# Altium schematic sheet Sheet1.SchDoc
size 431 x 279 mm; SheetNumber: 1; SheetTotal: 1
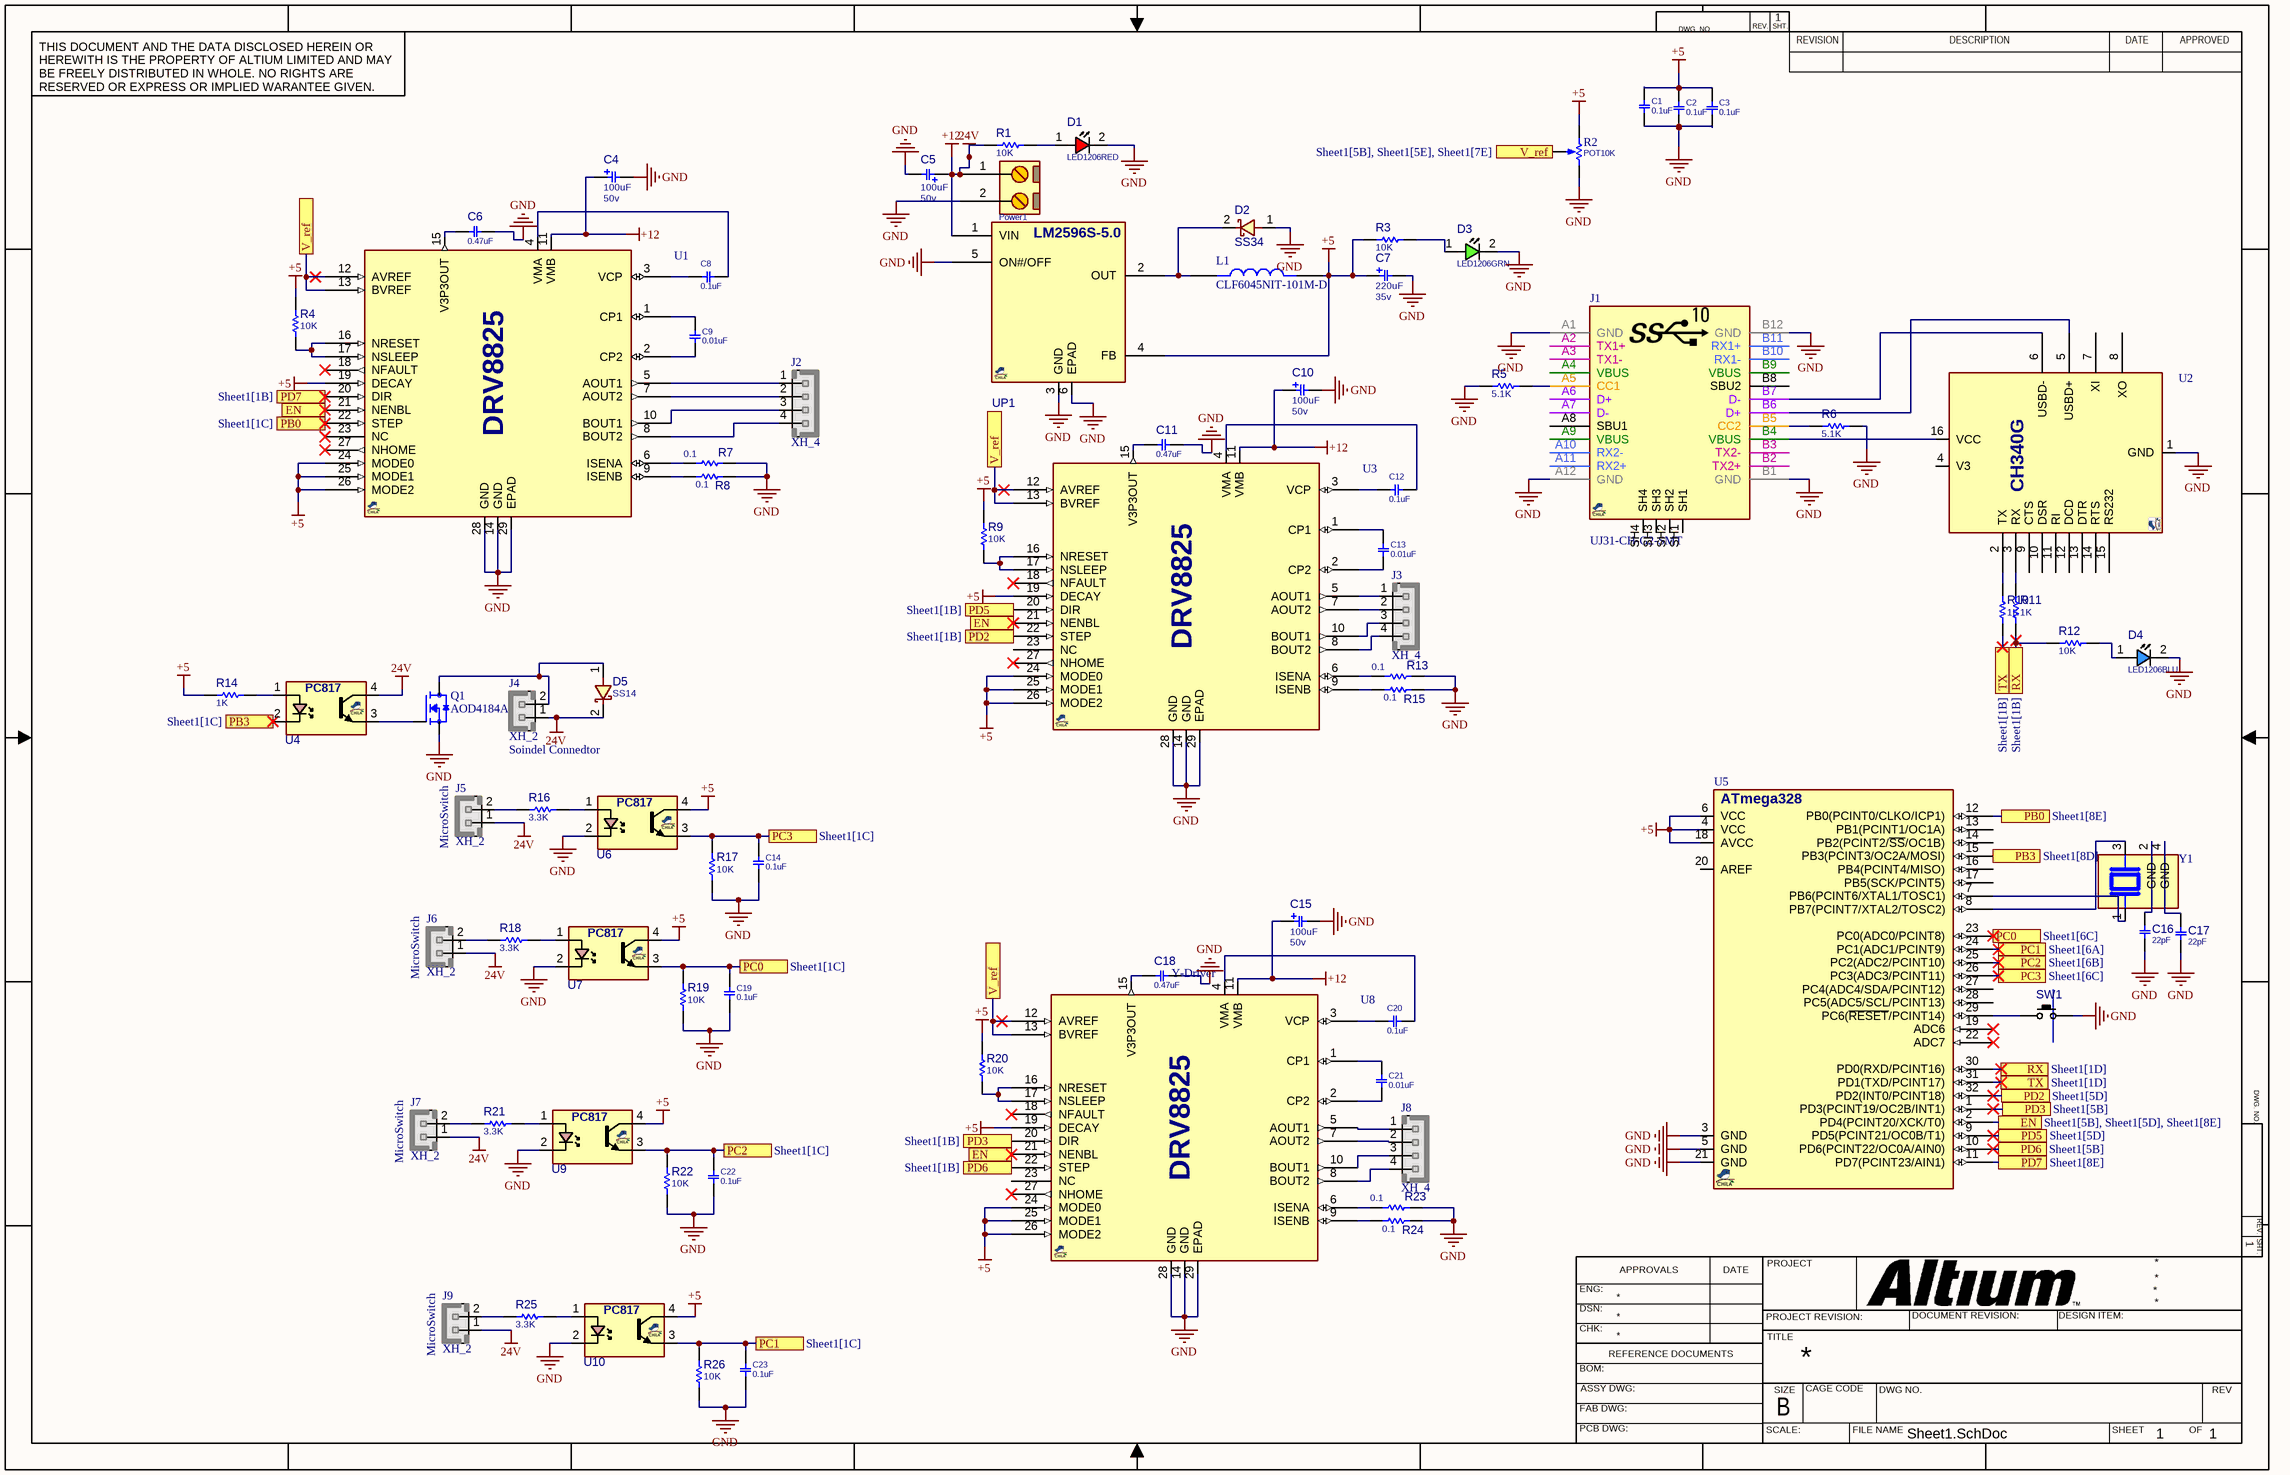
[diagram p0: Sheet1.SchDoc]

## Parts
C1  0.1uF  [C0402]
C2  0.1uF  [C0402]
C3  0.1uF  [C0402]
C4  PARAM2: 50v  [C_EL_D8L10]  (hidden comment: 100uF)
C5  PARAM2: 50v  [C_EL_D8L10]  (hidden comment: 100uF)
C6  0.47uF  [C0402]
C7  PARAM2: 35v  [C_EL_D8L10]  (hidden comment: 220uF)
C8  0.1uF  [C0402]
C9  0.01uF  [C0402]
C10  PARAM2: 50v  [C_EL_D8L10]  (hidden comment: 100uF)
C11  0.47uF  [C0402]
C12  0.1uF  [C0402]
C13  0.01uF  [C0402]
C14  0.1uF  [C0402]
C15  PARAM2: 50v  [C_EL_D8L10]  (hidden comment: 100uF)
C16  22pF  [C0402]
C17  22pF  [C0402]
C18  0.47uF  [C0402]
C19  0.1uF  [C0402]
C20  0.1uF  [C0402]
C21  0.01uF  [C0402]
C22  0.1uF  [C0402]
C23  0.1uF  [C0402]
D1  LED1206RED  [LED1206RED]
D2  SS34  [D_SMB]
D3  LED1206GRN  [LED1206GRN]
D4  LED1206BLU  [LED1206BLU]
D5  SS14  [D_SMB]
J1  UJ31-CH-G2-SMT  [USBC_HYB_UJ31CHG2SMT]
J2  XH_4  [XH_R_SMD_4]
J3  XH_4  [XH_R_SMD_4]
J4  Soindel Connedtor  value XH_2  [XH_R_SMD_2]
J5  MicroSwitch  value XH_2  [XH_R_SMD_2]
J6  MicroSwitch  value XH_2  [XH_R_SMD_2]
J7  MicroSwitch  value XH_2  [XH_R_SMD_2]
J8  XH_4  [XH_R_SMD_4]
J9  MicroSwitch  value XH_2  [XH_R_SMD_2]
L1  CLF6045NIT-101M-D  [IND_CLF6045NIT-101M-D]
Power1  CONN_TB2  [TBG_2]  (value not drawn)
Q1  AOD4184A  [DPAK228P994X240-4N]
R1  10K  [R0402]
R2  POT10K  [POTS_3MM]
R3  10K  [R0402]
R4  10K  [R0402]
R5  5.1K  [R0402]
R6  5.1K  [R0402]
R7  0.1  [R0402]
R8  0.1  [R0402]
R9  10K  [R0402]
R10  1K  [R0402]
R11  1K  [R0402]
R12  10K  [R0402]
R13  0.1  [R0402]
R14  1K  [R0402]
R15  0.1  [R0402]
R16  3.3K  [R0402]
R17  10K  [R0402]
R18  3.3K  [R0402]
R19  10K  [R0402]
R20  10K  [R0402]
R21  3.3K  [R0402]
R22  10K  [R0402]
R23  0.1  [R0402]
R24  0.1  [R0402]
R25  3.3K  [R0402]
R26  10K  [R0402]
SW1  PUSHBUTTON  [SWPBT_SPST_6X6X5]  (value not drawn)
U1  Z_Driver  [SOG65_28T]  (value not drawn)
U2  CH340G  [SO_16]  (value not drawn)
U3  X_Driver  [SOG65_28T]  (value not drawn)
U4  PC817  [DIP_4]  (value not drawn)
U5  ATMEGA328  [QFG80_32]  (value not drawn)
U6  PC817  [DIP_4]  (value not drawn)
U7  PC817  [DIP_4]  (value not drawn)
U8  Y-Driver  [SOG65_28T]
U9  PC817  [DIP_4]  (value not drawn)
U10  PC817  [DIP_4]  (value not drawn)
UP1  LM2596S-5.0  [D2PAK_5]  (value not drawn)
Y1  C3E-16.000-10-3030-R  [XTAL_C3E-16.000-10-3030-R]  (value not drawn)

## Ports
EN (see Sheet1[1B], Sheet1[5B], Sheet1[5D]), EN (see Sheet1[1B], Sheet1[5B], Sheet1[8E]), EN (see Sheet1[1B], Sheet1[5D], Sheet1[8E]), EN (see Sheet1[5B], Sheet1[5D], Sheet1[8E]), PB0 (see Sheet1[1C]), PB0 (see Sheet1[8E]), PB3 (see Sheet1[1C]), PB3 (see Sheet1[8D]), PC0 (see Sheet1[1C]), PC0 (see Sheet1[6C]), PC1 (see Sheet1[1C]), PC1 (see Sheet1[6A]), PC2 (see Sheet1[1C]), PC2 (see Sheet1[6B]), PC3 (see Sheet1[1C]), PC3 (see Sheet1[6C]), PD2 (see Sheet1[1B]), PD2 (see Sheet1[5D]), PD3 (see Sheet1[1B]), PD3 (see Sheet1[5B]), PD5 (see Sheet1[1B]), PD5 (see Sheet1[5D]), PD6 (see Sheet1[1B]), PD6 (see Sheet1[5B]), PD7 (see Sheet1[1B]), PD7 (see Sheet1[8E]), RX (see Sheet1[1B]), RX (see Sheet1[1D]), TX (see Sheet1[1B]), TX (see Sheet1[1D]), V_ref (see Sheet1[3F], Sheet1[5B], Sheet1[5E]), V_ref (see Sheet1[3F], Sheet1[5B], Sheet1[7E]), V_ref (see Sheet1[3F], Sheet1[5E], Sheet1[7E]), V_ref (see Sheet1[5B], Sheet1[5E], Sheet1[7E])

## Nets
+5: C1.2 C2.2 C3.1 C7.1 L1.2 R2.1(TOP) R3.1 R4.2 R9.2 R14.1 R20.2 U1.19(DECAY) U1.24(MODE0) U1.25(MODE1) U1.26(MODE2) U3.19(DECAY) U3.24(MODE0) U3.25(MODE1) U3.26(MODE2) U5.4(VCC) U5.6(VCC) U5.18(AVCC) U6.4(C) U7.4(C) U8.19(DECAY) U8.24(MODE0) U8.25(MODE1) U8.26(MODE2) U9.4(C) U10.4(C) UP1.4(FB)
+12: C4.1 C5.1 C10.1 C15.1 D5.2 J4.1 J5.1 J6.1 J7.1 J9.1 Power1.1 R1.1 U1.11(VMB) U3.11(VMB) U4.4(C) U8.11(VMB) UP1.1(VIN)  [also labelled 24V]
GND: C1.1 C2.1 C3.2 C4.2 C5.2 C6.2 C7.2 C10.2 C11.2 C14.1 C15.2 C16.2 C17.1 C18.2 C19.1 C22.1 C23.1 D1.2(CATHODE) D2.1 D3.2(CATHODE) D4.2(CATHODE) J1.A1(GND) J1.A12(GND) J1.B1(GND) J1.B12(GND) Power1.2 Q1.3(S) R2.3(BOT) R5.1 R6.2 R7.2 R8.2 R13.2 R15.2 R17.1 R19.1 R22.1 R23.2 R24.2 R26.1 SW1.2 U1.14(GND) U1.28(GND) U1.29(EPAD) U2.1(GND) U3.14(GND) U3.28(GND) U3.29(EPAD) U5.3(GND) U5.5(GND) U5.21(GND) U6.2(K) U7.2(K) U8.14(GND) U8.28(GND) U8.29(EPAD) U9.2(K) U10.2(K) UP1.3(GND) UP1.5(ON#/OFF) UP1.6(EPAD)
EN: U1.21(NENBL) U3.21(NENBL) U5.2(PD4(PCINT20/XCK/T0)) U8.21(NENBL) ; port EN
PB0: U1.22(STEP) U5.12(PB0(PCINT0/CLKO/ICP1)) ; port PB0
PB3: U4.2(K) U5.15(PB3(PCINT3/OC2A/MOSI)) ; port PB3
PC0: C19.2 R19.2 U5.23(PC0(ADC0/PCINT8)) U7.3(E) ; port PC0
PC1: C23.2 R26.2 U5.24(PC1(ADC1/PCINT9)) U10.3(E) ; port PC1
PC2: C22.2 R22.2 U5.25(PC2(ADC2/PCINT10)) U9.3(E) ; port PC2
PC3: C14.2 R17.2 U5.26(PC3(ADC3/PCINT11)) U6.3(E) ; port PC3
PD2: U3.22(STEP) U5.32(PD2(INT0/PCINT18)) ; port PD2
PD3: U5.1(PD3(PCINT19/OC2B/INT1)) U8.20(DIR) ; port PD3
PD5: U3.20(DIR) U5.9(PD5(PCINT21/OC0B/T1)) ; port PD5
PD6: U5.10(PD6(PCINT22/OC0A/AIN0)) U8.22(STEP) ; port PD6
PD7: U1.20(DIR) U5.11(PD7(PCINT23/AIN1)) ; port PD7
RX: R11.1 R12.1 U5.30(PD0(RXD/PCINT16)) ; port RX
TX: R10.1 U5.31(PD1(TXD/PCINT17)) ; port TX
V_ref: R2.2(TAP) U1.12(AVREF) U1.13(BVREF) U3.12(AVREF) U3.13(BVREF) U8.12(AVREF) U8.13(BVREF) ; port V_ref
NetC6_1: C6.1 U1.15(V3P3OUT)
NetC8_1: C8.1 U1.3(VCP)
NetC8_2: C8.2 U1.4(VMA)
NetC9_1: C9.1 U1.1(CP1)
NetC9_2: C9.2 U1.2(CP2)
NetC11_1: C11.1 U3.15(V3P3OUT)
NetC12_1: C12.1 U3.3(VCP)
NetC12_2: C12.2 U3.4(VMA)
NetC13_1: C13.1 U3.1(CP1)
NetC13_2: C13.2 U3.2(CP2)
NetC16_1: C16.1 Y1.2(GND)
NetC17_2: C17.2 Y1.4(GND)
NetC18_1: C18.1 U8.15(V3P3OUT)
NetC20_1: C20.1 U8.3(VCP)
NetC20_2: C20.2 U8.4(VMA)
NetC21_1: C21.1 U8.1(CP1)
NetC21_2: C21.2 U8.2(CP2)
NetD1_1: D1.1(ANODE) R1.2
NetD2_2: D2.2 L1.1 UP1.2(OUT)
NetD3_1: D3.1(ANODE) R3.2
NetD4_1: D4.1(ANODE) R12.2
NetD5_1: D5.1 J4.2 Q1.4(D)
NetJ1_A5: J1.A5(CC1) R5.2
NetJ1_B4: J1.B4(VBUS) U2.16(VCC)
NetJ1_B5: J1.B5(CC2) R6.1
NetJ1_B6: J1.B6(D+) U2.5(USBD+)
NetJ1_B7: J1.B7(D-) U2.6(USBD-)
NetJ2_1: J2.1 U1.5(AOUT1)
NetJ2_2: J2.2 U1.7(AOUT2)
NetJ2_3: J2.3 U1.10(BOUT1)
NetJ2_4: J2.4 U1.8(BOUT2)
NetJ3_1: J3.1 U3.5(AOUT1)
NetJ3_2: J3.2 U3.7(AOUT2)
NetJ3_3: J3.3 U3.10(BOUT1)
NetJ3_4: J3.4 U3.8(BOUT2)
NetJ5_2: J5.2 R16.1
NetJ6_2: J6.2 R18.1
NetJ7_2: J7.2 R21.1
NetJ8_1: J8.1 U8.5(AOUT1)
NetJ8_2: J8.2 U8.7(AOUT2)
NetJ8_3: J8.3 U8.10(BOUT1)
NetJ8_4: J8.4 U8.8(BOUT2)
NetJ9_2: J9.2 R25.1
NetQ1_1: Q1.1(G) U4.3(E)
NetR4_1: R4.1 U1.16(NRESET) U1.17(NSLEEP)
NetR7_1: R7.1 U1.6(ISENA)
NetR8_1: R8.1 U1.9(ISENB)
NetR9_1: R9.1 U3.16(NRESET) U3.17(NSLEEP)
NetR10_2: R10.2 U2.2(TX)
NetR11_2: R11.2 U2.3(RX)
NetR13_1: R13.1 U3.6(ISENA)
NetR14_2: R14.2 U4.1(A)
NetR15_1: R15.1 U3.9(ISENB)
NetR16_2: R16.2 U6.1(A)
NetR18_2: R18.2 U7.1(A)
NetR20_1: R20.1 U8.16(NRESET) U8.17(NSLEEP)
NetR21_2: R21.2 U9.1(A)
NetR23_1: R23.1 U8.6(ISENA)
NetR24_1: R24.1 U8.9(ISENB)
NetR25_2: R25.2 U10.1(A)
NetSW1_1: SW1.1 U5.29(PC6(~{RESET}/PCINT14))
NetU5_7: U5.7(PB6(PCINT6/XTAL1/TOSC1)) Y1.1
NetU5_8: U5.8(PB7(PCINT7/XTAL2/TOSC2)) Y1.3

Not connected (* = marked no-connect by the designer): J1 A2(TX1+) A3(TX1-) A4(VBUS) A6(D+) A7(D-) A8(SBU1) A9(VBUS) A10(RX2-) A11(RX2+) B2(TX2+) B3(TX2-) B8(SBU2) B9(VBUS) B10(RX1-) B11(RX1+) SH1 SH2 SH3 SH4; U1 18(NFAULT)* 23(NC)* 27(NHOME)*; U2 4(V3) 7(XI) 8(XO) 9(CTS) 10(DSR) 11(RI) 12(DCD) 13(DTR) 14(RTS) 15(RS232); U3 18(NFAULT)* 23(NC) 27(NHOME)*; U5 13(PB1(PCINT1/OC1A)) 14(PB2(PCINT2/~{SS}/OC1B)) 16(PB4(PCINT4/MISO)) 17(PB5(SCK/PCINT5)) 19(ADC6)* 20(AREF) 22(ADC7)* 27(PC4(ADC4/SDA/PCINT12)) 28(PC5(ADC5/SCL/PCINT13)); U8 18(NFAULT)* 23(NC) 27(NHOME)*

## Notes on the sheet
- DWG. NO.
- REV.
- SHT.
- THIS DOCUMENT AND THE DATA DISCLOSED HEREIN OR HEREWITH IS THE PROPERTY OF ALTIUM LIMITED AND MAY BE FREELY DISTRIBUTED IN WHOLE. NO RIGHTS ARE RESERVED OR EXPRESS OR IMPLIED WARANTEE GIVEN.
- REVISION
- DESCRIPTION
- DATE
- APPROVED
- ENG:
- APPROVALS
- PROJECT
- DSN:
- CHK:
- REFERENCE DOCUMENTS
- PROJECT REVISION:
- TITLE
- DOCUMENT REVISION:
- DESIGN ITEM:
- BOM:
- FAB DWG:
- PCB DWG:
- ASSY DWG:
- SCALE:
- SIZE
- B
- CAGE CODE
- FILE NAME
- DWG NO.
- SHEET
- OF
- REV
- (in symbol ATMEGA328P_QFP32) ATmega328

## Library data of the parts
C1-C3 C14 C19 C22 C23 = CAP_SMD_MLCC_100n50TDK: CAP, MLCC, 100nF, 50V, X7R, 10%, 0402C; PARAM: X7R, 10%, -55~125oC; MANF_P#: CGA2B3X7R1H104K050BE; MANF: TDK; PARAM2: 50V; ASSEMBLY: ASSEMBLY; PRICE: 100= 6$; VALUE: 0.1uF
C4 C5 C10 C15 = CAP_SMD_EL_100uF_50v: CAP, SMD, ELEC,; MANF_P#: MANF_PART#; DESC: DESCRIPTION; DIST#: MOUSER; PARAM: 20%; PRICE: 10= -$; MANF: MANF; ASSEMBLY: ASSEMBLY; VALUE: 100uF
C6 C11 C18 = CAP_SMD_MLCC_470n25V: CAP, MLCC, 16V,+/-10%,X7R; MANF_P#: C1005X5R1E474K050BB; MANF: TDK; PARAM: X5R, 10%; DIST#: MOUSER; PARAM2: 25V; ASSEMBLY: ASSEMBLY; PRICE: 100= 3$; DESC: CAP, MLCC; VALUE: 0.47uF
C7 = CAP_SMD_EL_220uF_35v: CAP, SMD, ELEC,; MANF_P#: MANF_PART#; DESC: DESCRIPTION; DIST#: MOUSER; PARAM: 20%; PRICE: 10= -$; MANF: MANF; ASSEMBLY: ASSEMBLY; VALUE: 220uF
C8 C12 C20 = CAP_SMD_MLCC_100n35T: CAP, MLCC, 100nF, 35V, X5R, 10%, 0402C; PARAM: X5R, 10%, -55~85oC; MANF_P#: GMK105BJ104KV-F; MANF: Taiyo Yuden; PARAM2: 35V; ASSEMBLY: ASSEMBLY; PRICE: 100= 4$; VALUE: 0.1uF
C9 C13 C21 = CAP_SMD_MLCC_10n50V: CAP, MLCC, 10nF, 50V, X7R, 10%, 0402C; MANF_P#: GCM155R71H103KA55D; MANF: Murata; PARAM: X7R, 10%; PARAM2: 50V; DESC: CAP, MLCC, 10nF, 50V, X7R, 10%, 0402C; VALUE: 0.01uF
C16 C17 = CAP_SMD_MLCC_22p50V: CAP, MLCC, 50V, C0G, 2%; MANF_P#: GRM1555C1H220GA01D; MANF: MURATA; PARAM: C0G, 2%; DIST#: MOUSER; ASSEMBLY: ASSEMBLY; PRICE: 100= 2.4$; DESC: CAP, MLCC; PARAM2: 50V; VALUE: 22pF
D1 = LED_SMD_1206_RED: LED, SMD, 1206, RED; DESC: DESCRIPTION; MANF_P#: MANF_PART#; PARAM2: 2.2V; MANF: MANF; ASSEMBLY: ASSEMBLY; PRICE: 36t@Javan; VALUE: LED1206RED
D2 = DIODE_SMD_SCHOTTKY_SS34: DIODE, SCHOTTKY, 20V, 3A; MANF: VISHAY; DESC: DESCRIPTION; MANF_P#: SS34; ASSEMBLY: ASSEMBLY; PRICE: PRICE; PARAM2: 3A; PARAM: 20V; VALUE: SS34
D3 = LED_SMD_1206_GRN: LED, SMD, 1206, GREEN; PARAM: 20mA; DESC: DESCRIPTION; PARAM2: 2.2V; MANF: -; ASSEMBLY: ASSEMBLY; PRICE: 36t@Javan; MANF_P#: -; VALUE: LED1206GRN
D4 = LED_SMD_1206_BLU: LED, SMD, 1206, BLUE; DESC: DESCRIPTION; MANF_P#: MANF_PART#; PARAM2: 2.2V; MANF: MANF; ASSEMBLY: ASSEMBLY; PRICE: 36t@Javan; VALUE: LED1206BLU
D5 = DIODE_SMD_SCHOTTKY_SS14: DIODE, SCHOTTKY, 40V, 1A; MANF: Vishay; DESC: DESCRIPTION; MANF_P#: SS14-E3; ASSEMBLY: ASSEMBLY; PRICE: PRICE; PARAM2: 1A; PARAM: 40V; VALUE: SS14
J1 = CONN_USBC_HYB_UJ31-CH-G2-SMT: CONN, USB, Type C, USB 3.1 Gen 2, Right-Angle, HYBRID; MANF: CUI Devices; MANF_P#: UJ31-CH-G2-SMT-TR; PARAM: 5A; Price: None; Value: UJ31-CH-G2-SMT
J2 J3 J8 = XH_R_SMD_4: JST-SxB-XH-SM4 pitch: 2.5mm, 3A/250v; MANF: JST; MANF_P#: S4B-XH-A; PARAM2: 250v; PARAM: 3.0A; VALUE: XH_4
J4-J7 J9 = XH_R_SMD_2: JST-SxB-XH-SM4 pitch: 2.5mm, 3A/250v; MANF: JST; MANF_P#: S2B-XH-A; PARAM2: 250v; PARAM: 3.0A
L1 = CLF6045NIT-101M-D: 100 ÂµH Shielded Drum Core, Wirewound Inductor 610 mA 384mOhm Max Nonstandard; MF: TDK; SnapEDA_Link: https://www.snapeda.com/parts/CLF6045NIT-101M-D/TDK/view-part/?ref=snap; Digi-Key_Part_Number: 445-174377-2-ND; MP: CLF6045NIT-101M-D; Package: NON STANDARD-2 TDK; Purchase-URL: https://pricing.snapeda.com/search/part/CLF6045NIT-101M-D/?ref=eda; Value: *; Check_prices: https://www.snapeda.com/parts/CLF6045NIT-101M-D/TDK/view-part/?ref=eda
Power1 = CONN_TB2: CONN, TERMINAL BLOCK, 5.08mm pitch; VALUE: CONN_TB2
Q1 = AOD4184A: N-Channel 40 V 13A (Ta), 50A (Tc) 2.3W (Ta), 50W (Tc) Surface Mount TO-252 (DPAK); MF: Alpha & Omega Semiconductor Inc.; SnapEDA_Link: https://www.snapeda.com/parts/AOD4184A/Alpha+%2526+Omega+Semiconductor+Inc./view-part/?ref=snap; Package: None; Value: *; MP: AOD4184A; Check_prices: https://www.snapeda.com/parts/AOD4184A/Alpha+%2526+Omega+Semiconductor+Inc./view-part/?ref=eda
R1 R3-R26 = RES_SMD: RESISTOR, SMD; PARAM: -W; DESC: DESCRIPTION; DIST#: MOUSER; PARAM2: 1%; MANF_P#: -; MANF: -; ASSEMBLY: ASSEMBLY; PRICE: 100= 0.5$
  R1 R3 R4 R9 R12 R17 R19 R20 R22 R26: VALUE: 10K
  R5 R6: VALUE: 5.1K
  R7 R8 R13 R15 R23 R24: VALUE: 0.1
  R10 R11 R14: VALUE: 1K
  R16 R18 R21 R25: VALUE: 3.3K
R2 = RES_SMD_POT_3MM: RESISTOR, SMD, Potentiometer, 3mm; VALUE: POT10K
SW1 = SWPBT_SPST_6X6X5: SWITCH, PUSH BUTTON, TACTILE, THD, SPST, 6X6X5mm; DESC: DESCRIPTION; MANF: -; VALUE: PUSHBUTTON; ASSEMBLY: ASSEMBLY; PARAM: PARAM; PRICE: PRICE; MANF_P#: -
U1 U3 U8 = DRV8825_SSOP28: Driver, DC Motor, Stepper, Up to 1/32 stepping; MANF: Texas Instruments; MANF_P#: DRV8825PWPR; PARAM2: 8.2~45V; PARAM: 2.5A@24V; VALUE: DRV8825
U2 = CH340G_SOP16: USB-UART; MANF_P#: CH340G; VALUE: CH340G; PACKAGE: SOP-16
U4 U6 U7 U9 U10 = OPTC_TR4P_PC817: OPTOCOUPLER, TRANSISTOR, 4PIN; PARAM: IF=20mA; PARAM2: VCE = 35V; MANF: SHARP; MANF_P#: PC817; PRICE: -; VALUE: PC817; PACKAGE: DIP-4
U5 = ATMEGA328P_QFP32: MCU, AVR, 8-Bit, 16KB, 1KB RAM, 20MHz; PART#ALT: ATmega8-48-88-168-328; MANF_P#: ATMEGA328P-AU; DESC: 1KB EEPROM; MANF: ATMEL/MICROCHIP; PARAM2: 1.8~5.5V; PARAM: 32KB, 2KB RAM, 20MHz, -40~85°C; PRICE: 2$; VALUE: ATMEGA328
UP1 = VREG_LM2596S-5.0_D2PAK: REG, Switching, Buck, 3A, 5V, 150KHz, TO-220; MANF: TI, ON, TS; PARAM: 3A, 5V; DESC: REG, Switching, Buck, 3A, ADJ, 150KHz, TO-220; PARAM2: 150KHz, 40VIN; MANF_P#: LM2596S-ADJ; ASSEMBLY: ASSEMBLY; PRICE: PRICE; VALUE: LM2596S-5.0; PACKAGE: D2PAK-5 (TO-263-5)
Y1 = C3E-16.000-10-3030-R: Package: None; Price: None; Value: *; MP: C3E-16.000-10-3030-R; Availability: Unavailable